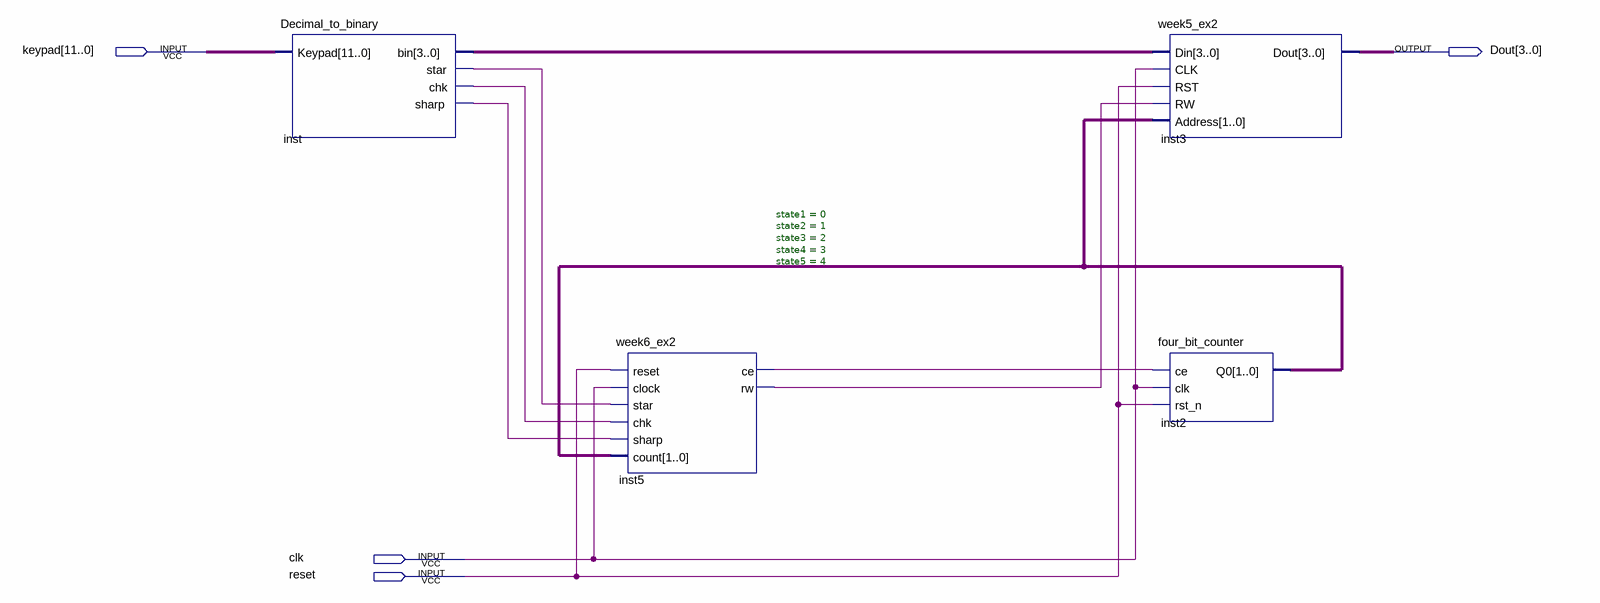
[diagram p0: schematic sheet]
// Quartus schematic week6_ex2_bdf.bdf as structural Verilog: 4 symbols, 4 pins
module week6_ex2_bdf (
  input  [11:0] keypad,
  input  clk,
  input  reset,
  output [3:0] Dout
);

  wire inst5_ce, inst5_rw, inst_chk, inst_sharp, inst_star;
  wire [1:0] inst2_q0;
  wire [3:0] inst_bin;

  Decimal_to_binary inst (.Keypad(keypad), .bin(inst_bin), .star(inst_star), .chk(inst_chk), .sharp(inst_sharp));
  week6_ex2 #(.state1(0), .state2(1), .state3(2), .state4(3), .state5(4)) inst5 (
    .reset(reset), .clock(clk), .star(inst_star), .chk(inst_chk), .sharp(inst_sharp), .count(inst2_q0),
    .ce(inst5_ce), .rw(inst5_rw));
  week5_ex2 inst3 (.Din(inst_bin), .CLK(clk), .RST(reset), .RW(inst5_rw), .Address(inst2_q0), .Dout(Dout));
  four_bit_counter inst2 (.ce(inst5_ce), .clk(clk), .rst_n(reset), .Q0(inst2_q0));
endmodule
